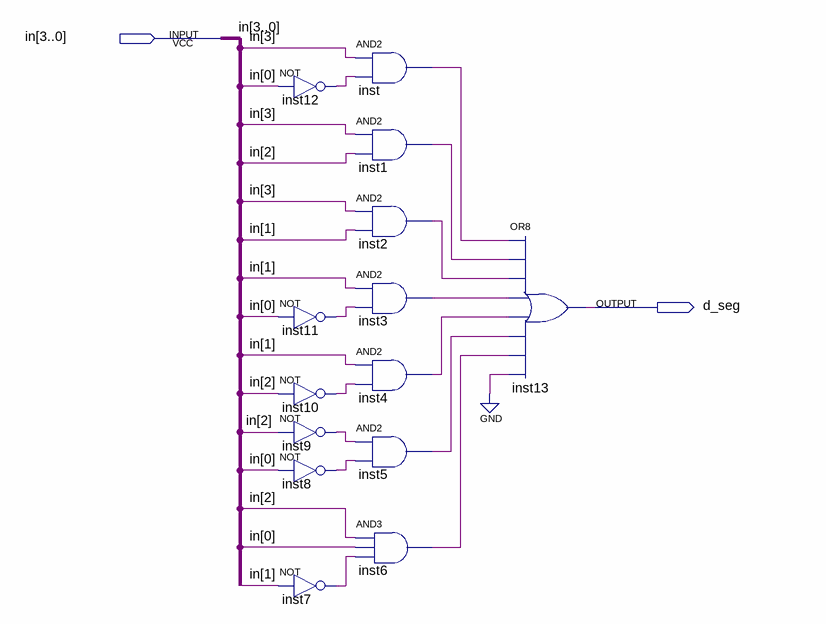
[diagram p0: schematic sheet]
// Quartus schematic d_seg.bdf as structural Verilog: 14 symbols, 2 pins
module d_seg (
  input  [3:0] in,
  output d_seg
);

  wire inst1_out, inst2_out, inst3_out, inst4_out, inst5_out, inst6_out, inst7_out, inst8_out, inst9_out,
       inst10_out, inst11_out, inst12_out, inst_out;

  not inst12 (inst12_out, in[0]);
  not inst11 (inst11_out, in[0]);
  not inst10 (inst10_out, in[2]);
  not inst9 (inst9_out, in[2]);
  not inst8 (inst8_out, in[0]);
  not inst7 (inst7_out, in[1]);
  and inst (inst_out, in[3], inst12_out);
  and inst1 (inst1_out, in[3], in[2]);
  and inst2 (inst2_out, in[3], in[1]);
  and inst3 (inst3_out, in[1], inst11_out);
  and inst4 (inst4_out, in[1], inst10_out);
  and inst5 (inst5_out, inst9_out, inst8_out);
  and inst6 (inst6_out, in[2], in[0], inst7_out);
  or inst13 (d_seg, inst_out, inst1_out, inst2_out, inst3_out, inst4_out, inst5_out, inst6_out, 1'b0);
endmodule
